# Altium schematic sheet 5V电源.SchDoc
size A4; SheetNumber: 3; SheetTotal: 3
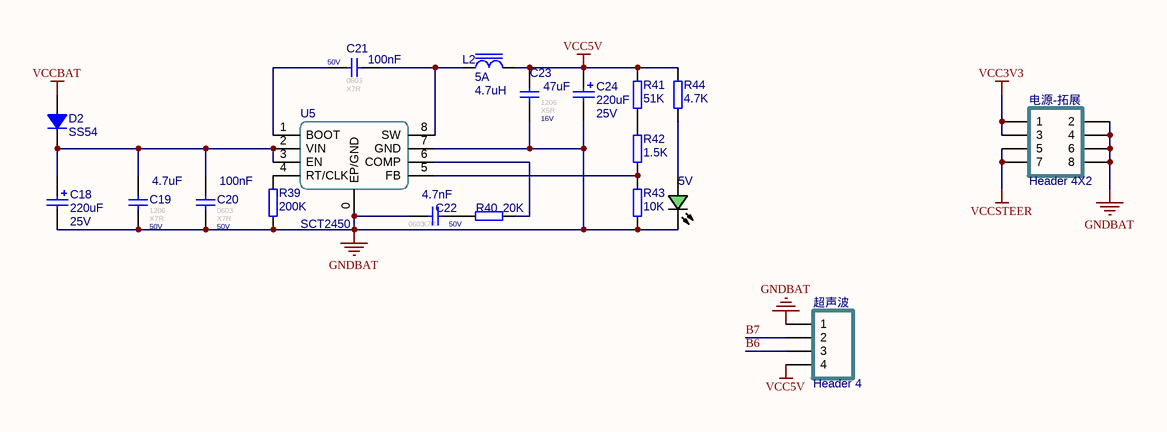
[diagram p0: 5V电源.SchDoc]

## Parts
5V  翠绿贴片LED  [LEDC1608(0603)-L]  (value not drawn)
C18  value 220uF  Voltage: 25V  [CAPS6.3]  (hidden comment: 220uF 25V)
C19  value 4.7uF  Footprint: 1206  Type: X7R  Voltage: 50V  [CAPC3216[1206]S]  (hidden comment: 4.7uF ±10% 50V)
C20  value 100nF  Footprint: 0603  Type: X7R  Voltage: 50V  [CAPC3216[1206]S]  (hidden comment: 100nF ±10% 50V)
C21  value 100nF  Footprint: 0603  Type: X7R  Voltage: 50V  [CAPC3216[1206]S]  (hidden comment: 100nF ±10% 50V)
C22  value 4.7nF  Footprint: 0603  Type: X7R  Voltage: 50V  [CAPC3216[1206]S]  (hidden comment: 4.7nF ±10% 50V)
C23  value 47uF  Footprint: 1206  Type: X5R  Voltage: 16V  [CAPC3216[1206]S]  (hidden comment: 47uF ±10% 16V)
C24  value 220uF  Voltage: 25V  [CAPS6.3]  (hidden comment: 220uF 25V)
D2  SS54  [SMA[DO-214AC]]
L2  value 4.7uH  Imax: 5A  [0630 TPC 7*7*3]  (hidden comment: 4.7uH 5A)
R39  value 200K  [RESC1608[0603]S-N]  (hidden comment: 200K ±1%)
R40  value 20K  [RESC1608[0603]S-N]  (hidden comment: 20K ±1%)
R41  value 51K  [RESC1608[0603]S-N]  (hidden comment: 51K ±1%)
R42  value 1.5K  [RESC1608[0603]S-N]  (hidden comment: 1.5K ±1%)
R43  value 10K  [RESC1608[0603]S-N]  (hidden comment: 10K ±1%)
R44  value 4.7K  [RESC1608[0603]S-N]  (hidden comment: 4.7K ±1%)
U5  SCT2450  [SOP-8E]
电源-拓展  Header 4X2  [HDR2X4-F-SMT]
超声波  Header 4  [HDR1X4]

## Nets
GNDBAT: 5V.C C18.2 C19.1 C20.1 C22.1 C23.1 C24.2 R39.1 R43.2 U5.0(EP/GND) U5.7(GND) 电源-拓展.2 电源-拓展.4 电源-拓展.6 电源-拓展.8 超声波.1
VCC3V3: 电源-拓展.1 电源-拓展.3
VCC5V: C23.2 C24.1 L2.2 R41.1 R44.1 超声波.4
VCCBAT: D2.A
VCCSTEER: 电源-拓展.5 电源-拓展.7
B6: 超声波.3
B7: 超声波.2
Net5V_A: 5V.A R44.2
NetC18_1: C18.1 C19.2 C20.2 D2.K U5.2(VIN) U5.3(EN)
NetC21_1: C21.1 U5.1(BOOT)
NetC21_2: C21.2 L2.1 U5.8(SW)
NetC22_2: C22.2 R40.1
NetR39_2: R39.2 U5.4(RT/CLK)
NetR40_2: R40.2 U5.6(COMP)
NetR41_2: R41.2 R42.1
NetR42_2: R42.2 R43.1 U5.5(FB)

## Library data of the parts
5V = LED Chip Green: Published: 8-Jun-2000; Revision: July-2002: Re-released for DXP Platform.; Publisher: Altium Limited; Price(RMB): 0.00
C18 C24 = Cap-Solid: Polarized Capacitor (Radial); Published: 8-Jun-2000; Revision: July-2002: Re-released for DXP Platform.; Publisher: Altium Limited; Price(RMB): 0.000
C19 = Cap-Chip_3: 贴片电容; Published: 2021-12-13; Revision: V1.2; Tolerance: ±10%
C20 C21 = Cap-Chip_2: 贴片电容; Published: 2021-12-13; Revision: V1.2; Tolerance: ±10%
C22 = Cap-Chip: 贴片电容; Published: 2021-12-13; Revision: V1.2; Tolerance: ±10%
C23 = Cap-Chip_1: 贴片电容; Published: 2021-12-13; Revision: V1.2; Tolerance: ±10%
D2 = Diode: 普通二极管 Diode; Imax: 500mA; Published: 8-Jun-2000; Revision: July-2002: Re-released for DXP Platform.; Publisher: Altium Limited; Price(RMB): 0.000
L2 = Ind-Power: 功率电感; DCR: .5m; Published: 8-Jun-2000; Revision: July-2002: Re-released for DXP Platform.; Publisher: Altium Limited; Price(RMB): 0.000
R39 = Res-Chip: 贴片电阻; Published: 8-Jun-2000; Revision: July-2002: Re-released for DXP Platform.; Tolerance: ±1%
R40 = Res-Chip_1: 贴片电阻; Published: 8-Jun-2000; Revision: July-2002: Re-released for DXP Platform.; Tolerance: ±1%
R41 = Res-Chip_2: 贴片电阻; Published: 8-Jun-2000; Revision: July-2002: Re-released for DXP Platform.; Tolerance: ±1%
R42 = Res-Chip_4: 贴片电阻; Published: 8-Jun-2000; Revision: July-2002: Re-released for DXP Platform.; Tolerance: ±1%
R43 = Res-Chip_3: 贴片电阻; Published: 8-Jun-2000; Revision: July-2002: Re-released for DXP Platform.; Tolerance: ±1%
R44 = Res-Chip_5: 贴片电阻; Published: 8-Jun-2000; Revision: July-2002: Re-released for DXP Platform.; Tolerance: ±1%
U5 = SCT2450: 3.8V-36V Vin, 5A, High Efficiency Synchronous Step-down DCDC Converter / with Programmable Frequency
电源-拓展 = Header 4X2: Header, 4-Pin, Dual row; LatestRevisionDate: 17-Jul-2002; LatestRevisionNote: Re-released for DXP Platform.; Publisher: Altium Limited; Price(RMB): 0.00
超声波 = Header 4: Header, 4-Pin; LatestRevisionDate: 17-Jul-2002; LatestRevisionNote: Re-released for DXP Platform.; Publisher: Altium Limited; Price(RMB): 0.00